# EAGLE schematic seven_segment_2 (EAGLE 6.5.0)
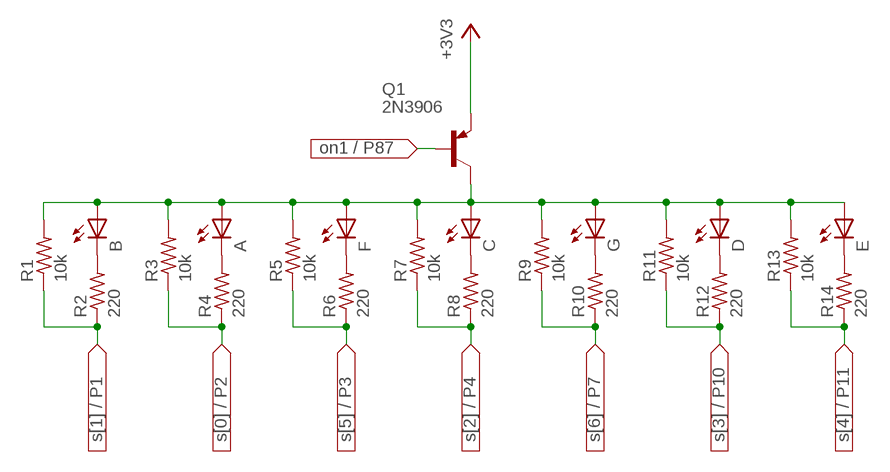
[diagram p0: schematic, sheet 1]

## Parts
A  LED5MM  [LED5MM]
B  LED5MM  [LED5MM]
C  LED5MM  [LED5MM]
D  LED5MM  [LED5MM]
E  LED5MM  [LED5MM]
F  LED5MM  [LED5MM]
G  LED5MM  [LED5MM]
Q1  2N3906  [TO92]
R1  10k  R-US_0411/12  [0411/12]
R2  220  R-US_0411/12  [0411/12]
R3  10k  R-US_0411/12  [0411/12]
R4  220  R-US_0411/12  [0411/12]
R5  10k  R-US_0411/12  [0411/12]
R6  220  R-US_0411/12  [0411/12]
R7  10k  R-US_0411/12  [0411/12]
R8  220  R-US_0411/12  [0411/12]
R9  10k  R-US_0411/12  [0411/12]
R10  220  R-US_0411/12  [0411/12]
R11  10k  R-US_0411/12  [0411/12]
R12  220  R-US_0411/12  [0411/12]
R13  10k  R-US_0411/12  [0411/12]
R14  220  R-US_0411/12  [0411/12]

## Nets
+3V3: Q1.3(E)
N$1: A.A B.A C.A D.A E.A F.A G.A Q1.1(C) R1.2 R3.2 R5.2 R7.2 R9.2 R11.2 R13.2
N$2: B.K(C) R2.2
N$3: R1.1 R2.1
N$4: A.K(C) R4.2
N$5: R3.1 R4.1
N$6: F.K(C) R6.2
N$7: R5.1 R6.1
N$8: C.K(C) R8.2
N$9: R7.1 R8.1
N$10: G.K(C) R10.2
N$11: R9.1 R10.1
N$12: D.K(C) R12.2
N$13: R11.1 R12.1
N$14: E.K(C) R14.2
N$15: R13.1 R14.1
N$16: Q1.2(B)

## Library data of the parts
A B C D E F G = adafruit:LED: LED OSRAM: - CHIPLED LG R971, LG N971, LY N971, LG Q971, LY Q971, LO R971, LY R971 LH N974, LH R974 LS Q976, LO Q976, LY Q976 LO Q996 - Hyper CHIPLED LW Q18S LB Q993, LB Q99A, LB R99A - SideLED LS A670, LO A670, LY A670, LG A670, LP A670 LB A673, LV A673, LT A673, LW A673 LH A674 LY A675 LS A676, LA A676, LO A676, LY A676, LW A676 LS A679, LY A679, LG A679 - Hyper Micro SIDELED® LS Y876, LA Y876, LO Y876, LY Y876 LT Y87S - SmartLED LW L88C, LW L88S LB L89C, LB L89S, LG L890 LS L89K, LO L89K, LY L89K LS L896, LA L896, LO L896, LY L896 - TOPLED LS T670, LO T670, LY T670, LG T670, LP T670 LSG T670, LSP T670, LSY T670, LOP T670, LYG T670 LG T671, LOG T671, LSG T671 LB T673, LV T673, LT T673, LW T673 LH T674 LS T676, LA T676, LO T676, LY T676, LB T676, LH T676, LSB T676, LW T676 LB T67C, LV T67C, LT T67C, LS T67K, LO T67K, LY T67K, LW E67C LS E67B, LA E67B, LO E67B, LY E67B, LB E67C, LV E67C, LT E67C LW T67C LS T679, LY T679, LG T679 LS T770, LO T770, LY T770, LG T770, LP T770 LB T773, LV T773, LT T773, LW T773 LH T774 LS E675, LA E675, LY E675, LS T675 LS T776, LA T776, LO T776, LY T776, LB T776 LHGB T686 LT T68C, LB T68C - Hyper Mini TOPLED® LB M676 - Mini TOPLED Santana® LG M470 LS M47K, LO M47K, LY M47K Source: http://www.osram.convergy.de/
Q1 = transistor-pnp:2N3906: PNP Transistor
R1-R14 = resistor:R-US_: RESISTOR, American symbol